# EAGLE schematic Driver (EAGLE 8.7.1)
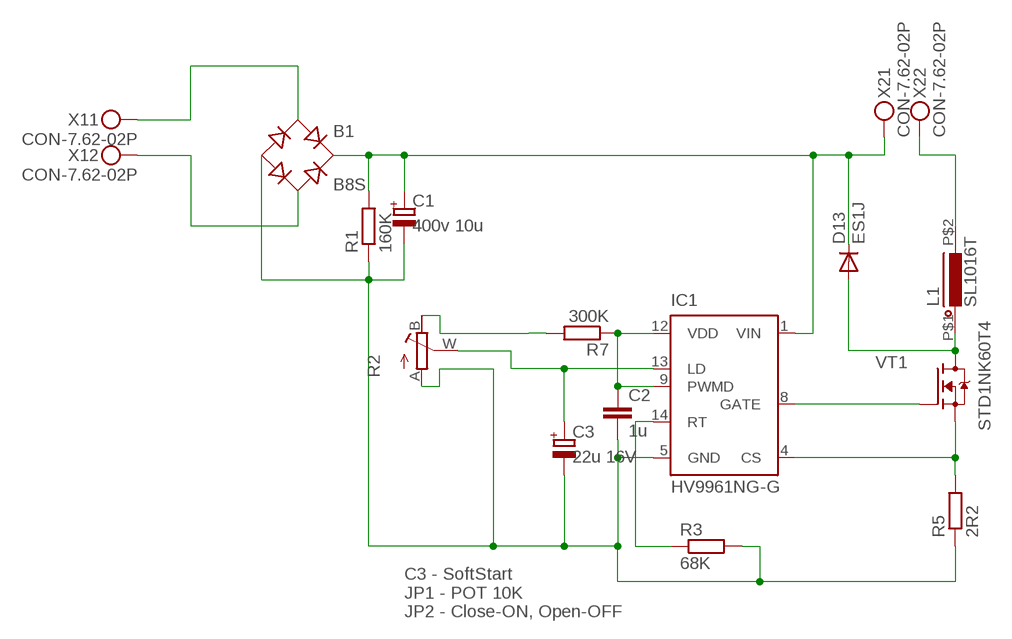
[diagram p0: schematic, sheet 1]

## Parts
B1  B8S  DF01S  [DFS]
C1  400v 10u  CAP-POL_E3.5-8  [E3,5-8]
C2  1u  CAP_0805  [C0805]
C3  22u 16V  CAP-POL_3528  [CT3528]
D13  ES1J  DIODE_ES1J  [DO214AC]
IC1  HV9961NG-G  HV9910BNG  [SOIC-16NG]
L1  SL1016T  INDUCTORSL1016  [SL1016]
R1  160K  R_MF-0125  [MF-0125]
R2  R_POTTURN-X  [RJ9W]
R3  68K  R_0805  [R0805]
R5  2R2  R_MF-05  [MF-05]
R7  300K  R_0805  [R0805]
VT1  STD1NK60T4  FET-NDPAK  [DPAK]
X1  CON-7.62-02P  [KF25C-7.62-02P-13]
X2  CON-7.62-02P  [KF25C-7.62-02P-13]

## Nets
N$2: R2.B(E) R7.2
N$3: C2.1 IC1.9(PWMD) IC1.12(VDD) R7.1
N$12: B1.AC1 X1.P$1
N$13: B1.AC2 X1.P$2
N$14: B1.- C1.- C2.2 C3.- IC1.5(GND) R1.1 R2.A R3.2 R5.1
N$15: C3.+ IC1.13(LD) R2.W(S)
N$17: B1.+ C1.+ D13.C IC1.1(VIN) R1.2 X2.P$1
N$19: IC1.4(CS) R5.2 VT1.S
N$20: IC1.14(RT) R3.1
N$21: IC1.8(GATE) VT1.G
N$22: L1.P$2 X2.P$2
N$23: D13.A L1.P$1 VT1.D

## Notes on the sheet
- C3 - SoftStart
  JP1 - POT 10K
  JP2 - Close-ON, Open-OFF

## Library data of the parts
B1 = rectifier:DF*S: Surface Mount Glass Passivated Bridge Rectifiers Source: Source: Comchip Bridge Rectifiers DF005S-G thru DF10S-G.pdf
C1 C3 = Namenlos:CAP-POL_
C2 = Namenlos:CAP_
D13 = Namenlos:DIODE_
IC1 = Namenlos:HV9910B: Universal High Brightness LED Driver Source: www.supertex.com .. led_driver_ics_SG.pdf; OC_FARNELL: unknown; OC_NEWARK: unknown
L1 = Namenlos:INDUCTOR
R1 R3 R7 = Namenlos:R_
R2 = Flamberm:R_POT
R5 = Flamberm:R_
VT1 = Namenlos:FET-N
X1 X2 = Namenlos:CON-7.62-02P